# Altium schematic sheet Sensor.SchDoc
size A; SheetNumber: 5; SheetTotal: 5
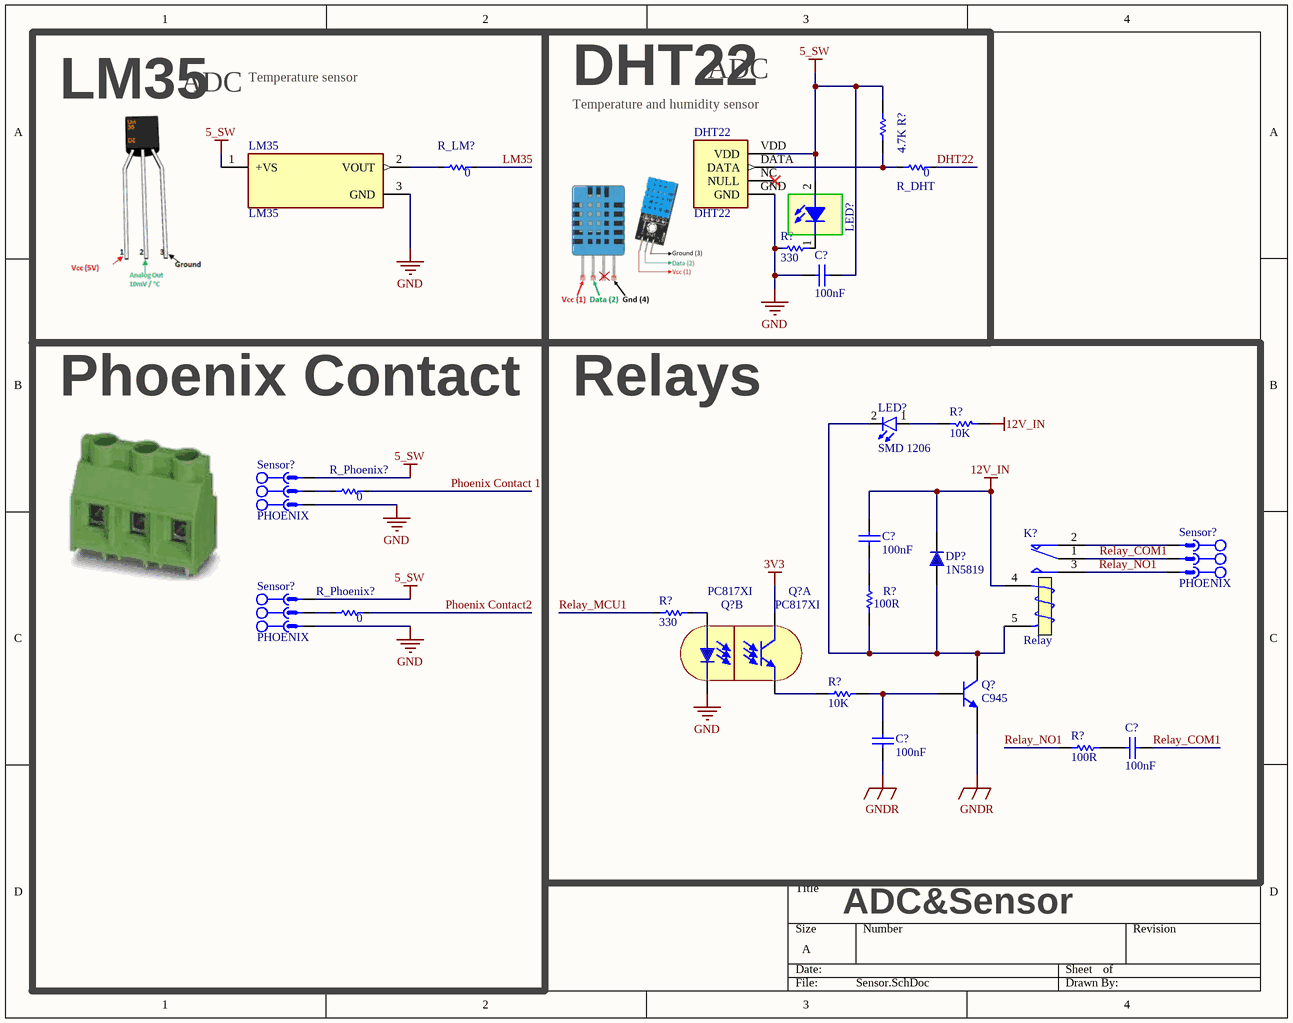
[diagram p0: Sensor.SchDoc]

## Parts
(Parts that share a designator on the sheet are numbered #1, #2 ... from top to bottom, then left to right.)
C?#1  100nF  [MY_CAP_SMD_0603]
C?#2  100nF  [MY_CAP_SMD_0603]
C?#3  100nF  [MY_CAP_SMD_0603]
C?#4  100nF  [MY_CAP_SMD_0603]
DHT22  DHT22  [DHT22]
DP?  1N5819  [1n58XX DO-201AD]
K?  Relay  [Relay 15.40x12.10x13.10]
LED?#1  SMD 1206 LED  [LED 1206]  (value not drawn)
LED?#2  Size: SMD 1206  [LED SMD 1206]  (hidden comment: Red)
LM35  LM35  [TO92127P521H735-3]
Q?#1  PC817XI  [SMT Gullwing Lead-Form]  (part B of 2)
Q?#2  PC817XI  [SMT Gullwing Lead-Form]  (part A of 2)
Q?#3  C945  [SOT23_N]
R?#1  4.7K  [RESC3413X04N]
R?#2  330  [0603]
R?#3  10K  [R0603]
R?#4  330  [0603]
R?#5  100R  [RESC3413X04N]
R?#6  10K  [RESC3413X04N]
R?#7  100R  [RESC3413X04N]
R_DHT  0  [0603]
R_LM?  0  [0603]
R_Phoenix?#1  0  [0603]
R_Phoenix?#2  0  [0603]
Sensor?#1  PHOENIX  [MSTB 2,5/3-G-5,08]
Sensor?#2  PHOENIX  [MSTB 2,5/3-G-5,08]
Sensor?#3  PHOENIX  [MSTB 2,5/3-G-5,08]

## Blocks framed on the sheet
LM35: LM35 R_LM?
DHT22: C?#1 DHT22 LED?#1 R?#1 R?#2 R_DHT
Phoenix Contact: R_Phoenix?#1 R_Phoenix?#2 Sensor?#1 Sensor?#3
Relays: C?#2-C?#4 DP? K? LED?#2 Q?#1-Q?#3 R?#3-R?#7 Sensor?#2

## Nets
3V3: Q?#2.4(C)
5_SW: C?#1.2 DHT22.VDD LED?#1.2 LM35.1(+VS) R?#1.2 Sensor?#1.3 Sensor?#3.3
12V_IN: C?#2.2 DP?.2 K?.4(T1) R?#3.2
GND: C?#1.1 DHT22.GND LM35.3(GND) Q?#1.2(K) R?#2.1 Sensor?#1.1 Sensor?#3.1
GNDR: C?#3.1 Q?#3.2(E)
DHT22: R_DHT.2
LM35: R_LM?.2
Phoenix Contact2: R_Phoenix?#2.2
Phoenix Contact 1: R_Phoenix?#1.2
Relay_COM1: C?#4.1 K?.1(COM) Sensor?#2.2
Relay_MCU1: R?#4.1
Relay_NO1: K?.3(NO) R?#7.2 Sensor?#2.1
NetC?#2_1: C?#2.1 R?#5.1
NetC?#3_2: C?#3.2 Q?#3.1(B) R?#6.1
NetC?#4_2: C?#4.2 R?#7.1
NetDHT22_DATA: DHT22.DATA R?#1.1 R_DHT.1
NetDP?_1: DP?.1 K?.5(T2) LED?#2.2(K) Q?#3.3(C) R?#5.2
NetK?_2: K?.2(NC) Sensor?#2.3
NetLED?#1_1: LED?#1.1 R?#2.2
NetLED?#2_1: LED?#2.1(A) R?#3.1
NetLM35_2: LM35.2(VOUT) R_LM?.1
NetQ?#1_1: Q?#1.1(A) R?#4.2
NetQ?#2_3: Q?#2.3(E) R?#6.2
NetR_Phoenix?#1_1: R_Phoenix?#1.1 Sensor?#1.2
NetR_Phoenix?#2_1: R_Phoenix?#2.1 Sensor?#3.2

Not connected (* = marked no-connect by the designer): DHT22 NC(NULL)*

## Notes on the sheet
- ADC
- Temperature sensor
- (near DHT22) Temperature and humidity sensor
- ADC&Sensor

## Library data of the parts
C?#1-C?#4 = CAP SMD_0603: 1.6 mm × 0.8 mm
DHT22 = DHT22: Capacitive-type humidity and temperature module/sensor; MF: Aosong Electronics; SnapEDA_Link: https://www.snapeda.com/parts/DHT22/Aosong+Electronics/view-part/?ref=snap; Package: Package; Value: *; MP: DHT22; Check_prices: https://www.snapeda.com/parts/DHT22/Aosong+Electronics/view-part/?ref=eda
DP? = 1N5819: Schottkey Rectifiers; Designer: Abbas Basereh; Data: 16-12-2016; Link: *; Part. No: *
K? = RELAY General: Relay_SPDT POWER NEEDLE; Designer: Ali Hafizi; Company: E.P.I.L; Design_Date: 2011/10/31
LED?#1 = LED SMD 1206
LED?#2 = LED: Designer: Eng. Saeid Jorablo; Company: SJ Libraries; ComponentLink1Description: Datasheet; ComponentLink2Description: Reference; Publisher: SJ Unlimited; Mounting Technology: Surface Mount\Through-Hole; Color: Red; HelpURL: http://s3.picofile.com/file/7443264187/Coming_Soon_logo.gif; Status: Unreleased
LM35 = LM35DZ/NOPB: Temperature Sensor Analog, Local 0Â°C ~ 100Â°C 10mV/Â°C TO-92-3; MP: LM35DZ; MF: Texas Instruments; Price: None; Availability: In Stock; Package: E-PKG AXIAL-LEADED-2 ON Semiconductor; Value: *; SnapEDA_Link: https://www.snapeda.com/parts/LM35DZ/Texas+Instruments/view-part/?ref=snap; Purchase-URL: https://pricing.snapeda.com/search/part/LM35DZ/?ref=eda; Check_prices: https://www.snapeda.com/parts/LM35DZ/Texas+Instruments/view-part/?ref=eda
Q?#1 Q?#2 = PC817XI: DIP 4pin General Purpose  Photocoupler; Published: 2017-2-27; DatasheetVersion: 2017-2-27; PackageVersion: 2017-2-27; PackageReference: SMT Gullwing Lead-Form; Publisher: Abbas Basereh; PackageDescription: SOP, 4-Leads, Body 4/65x6/75mm, Pitch 2/54mm, IPC Medium Density designer:abbas basereh; ComponentLink1Description: Manufacturer Link; ComponentLink1URL: http://www.roboeq.ir/files/id/233/name/PC817.pdf/; ComponentLink2Description: DIP 4pin General Purpose
Q?#3 = C945: NPN Silicon Epitaxial Planar Transistor; Published: 2017-2-8; LatestRevisionDate: 2017; LatestRevisionNote: IPC-7351 Footprint Added.; DatasheetVersion: 2017; PackageVersion: 2017-2-8; PackageReference: SOT23; Publisher: Abbas Basereh; PackageDescription: 3-Pin SOT-23 Package 0.95 mm Pitch, 2.3 mm Lead Span; ComponentLink1Description: Manufacturer Link; ComponentLink1URL: http://www.taitroncomponents.com/; ComponentLink2Description: Datasheet; ComponentLink2URL: http://www.taitroncomponents.com/
R?#1 R?#5-R?#7 = RES 0805 0.125W: RES 0805; Designer: Abbas Basereh; Desc.: RES SMD 0805; Data: 16-12-2016
R?#2 R?#4 R_DHT R_LM? R_Phoenix?#1 R_Phoenix?#2 = Res: Resistor; Published: 8-Jun-2000; LatestRevisionDate: 17-Jul-2002; LatestRevisionNote: Re-released for DXP Platform.; PackageReference: AXIAL-0.3; Publisher: Altium Limited
R?#3 = Resistor SMD 0603
Sensor?#1-Sensor?#3 = CON_Phoenix_MSTB_03: 3 Pitch: 5.08 mm Color: green Contact surface: Tin Assembly; Manufacturer: PHOENIX CONTACT; Connector type: PCB Terminal Block; designer: ABBAS BASEREH; Max Current: 12 A; Positions: 3; Voltage: 320 V; Category: Connector; ComponentLink1Description: Header, Nominal current: 12 A Rated voltage (III/2): 320 V Number of positions: 3 Pitch: 5.08 mm Color: green Contact surface: Tin Assembly: Soldering  DESIGNER:ABBAS BASEREH; ComponentLink2Description: Reference; Mounting Technology: Through-Hole; Pin Count: 3; Revision 1: 2017-3-1; Status: Unreleased; PART.NO: PHOENIX